# Altium schematic sheet Gas_Sampler-NOAA_Conn.SchDoc: NOAA Connector
size Tabloid; Organization: Sensible Robotics LLC; Address1: 120 E Church Ave Suite B; Address2: Ridgecrest CA, 93555; Revision: 0; SheetNumber: 10; SheetTotal: 12; ApprovedBy: Approved Name; Engineer: Mike Licitra; PageSetup: Record=PageOptions|CenterHorizontal=True|CenterVertical=True|PrintScale=0.98|XCorrection=1.00|YCorrection=1.00|PrintKind=0|BorderSize=5000000|LeftOffset=0|BottomOffset=0|Orientation=2|PaperLength=1000|PaperWidth=1000|Scale=100|PaperSource=15|PrintQuality=600|MediaType=1|DitherType=10|PaperKind=Tabloid|PrintScaleMode=1
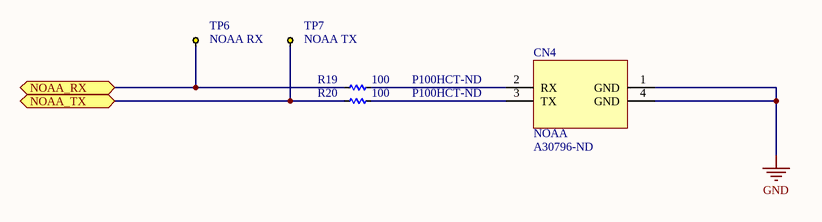
[diagram p0: Gas_Sampler-NOAA_Conn.SchDoc]

## Parts
CN4  NOAA  Supplier Part Number 1: A30796-ND  [TE_3-641216-4]
R19  value 100  Supplier Part Number 1: P100HCT-ND  [R0603]  (hidden comment: RES_0603_100_OHM_1/10W_1%)
R20  value 100  Supplier Part Number 1: P100HCT-ND  [R0603]  (hidden comment: RES_0603_100_OHM_1/10W_1%)
TP6  NOAA RX  [TP_KEYSTONE_5001]
TP7  NOAA TX  [TP_KEYSTONE_5001]

## Ports
NOAA_RX, NOAA_TX

## Nets
GND: CN4.1(GND) CN4.4(GND)
NOAA_RX: R19.1 TP6.1 ; port NOAA_RX
NOAA_TX: R20.1 TP7.1 ; port NOAA_TX
NetCN4_2: CN4.2(RX) R19.2
NetCN4_3: CN4.3(TX) R20.2

## Notes on the sheet
- CONFIDENTIAL DOCUMENT
- DUPLICATION PROHIBITED
- ENGINEER
- PCB FAB #
- SCH #
- REV
- Sensible
- Robotics
- THIS DOCUMENT CONTAINS INFORMATION AND OR DATA, WHICH IS PROPRIETARY AND CONFIDENTIAL TO SENSIBLE ROBOTICS LLC.  THIS INFORMATION AND OR DATA, IS TO BE USED ONLY FOR THE BENEFIT OF THE SUPPLIER, AND IS NOT TO BE USED FOR THE BENEFIT OF OTHER PARTIES WITHOUT WRITTEN CONSENT.
- DATE
- PCB ASSY #
- SIZE
- Tabloid
- SHEET
- OF
- FILE

## Library data of the parts
CN4 = CONN_NOAA_XDATA_RA_3-641216-4: CONN HEADER VERT 4POS 2.54MM; Manufacturer: TE Connectivity AMP Connectors; Number of Positions: 4; Pitch - Mating: 0.100" (2.54mm); Supplier 1: Digi-Key; Manufacturer Part Number: 3-641216-4; Packaging: Bulk; ComponentLink1URL: https://www.te.com/usa-en/product-3-641216-4.datasheet.pdf; ComponentLink1Description: Datasheet; Number of Rows: 1
R19 R20 = RES_0603_100_OHM_1/10W_1%: RES 100 OHM 1/10W 1% 0603 SMD; Manufacturer: Panasonic Electronic Components; Manufacturer Part Number: ERJ-3EKF1000V; Part Number: 470-00121-00; Power (Watts): 0.1W, 1/10W; Temperature Coefficient: ±100ppm/°C; Supplier 1: Digi-Key; RoHS: RoHS Compliant; Category: Resistors; Stock 1: 1025169; Pricing 1: 1=0.1, 50=0.0138, 100=0.0105, 250=0.0078, 500=0.00576, 1000=0.00384 (USD); Packaging: Cut Tape (CT); Composition: Thick Film; Features: -; Tolerance: ±1%; Package / Case: 0603 (1608 Metric); Supplier Device Package: 0603; Size / Dimension: 0.063" L x 0.031" W (1.60mm x 0.80mm); Height: 0.022" (0.55mm); Number of Terminations: 2; ComponentLink1URL: http://industrial.panasonic.com/www-cgi/jvcr13pz.cgi?E+PZ+3+AOA0002+ERJ3EKF1000V+7+WW; ComponentLink1Description: http://industrial.panasonic.com/www-cgi/jvcr13pz.cgi?E+PZ+3+AOA0002+ERJ3EKF1000V+7+WW
TP6 TP7 = TEST_KEYSTONE5001: PC TEST POINT TH RING; Manufacturer: Keystone Electronics; Manufacturer Part Number: 5001; Part Number: 250-00184-00; Supplier 1: Digi-Key; Supplier Part Number 1: 5001K-ND; RoHS: RoHS Compliant; Category: Test and Measurement; Stock 1: 341830; Pricing 1: 1=0.33, 10=0.309, 50=0.2252, 100=0.2164, 250=0.19432, 500=0.18548, 1000=0.15456, 2500=0.14131, 5000=0.13248 (USD); Packaging: Bulk; Type: PC Test Point, Miniature; Terminal: 0.010" x 0.020" (0.25mm x 0.51mm) Phosphor Bronze Wire, Silver Plate; Mounting Type: 0.040" (1.02mm) Hole Diameter; Material: Base, Nylon 46, UL 94V-0; Color: Black; ComponentLink1URL: http://www.keyelco.com/product-pdf.cfm?p=1310; ComponentLink1Description: http://www.keyelco.com/product-pdf.cfm?p=1310